# Altium schematic sheet UART2.SchDoc
size A2
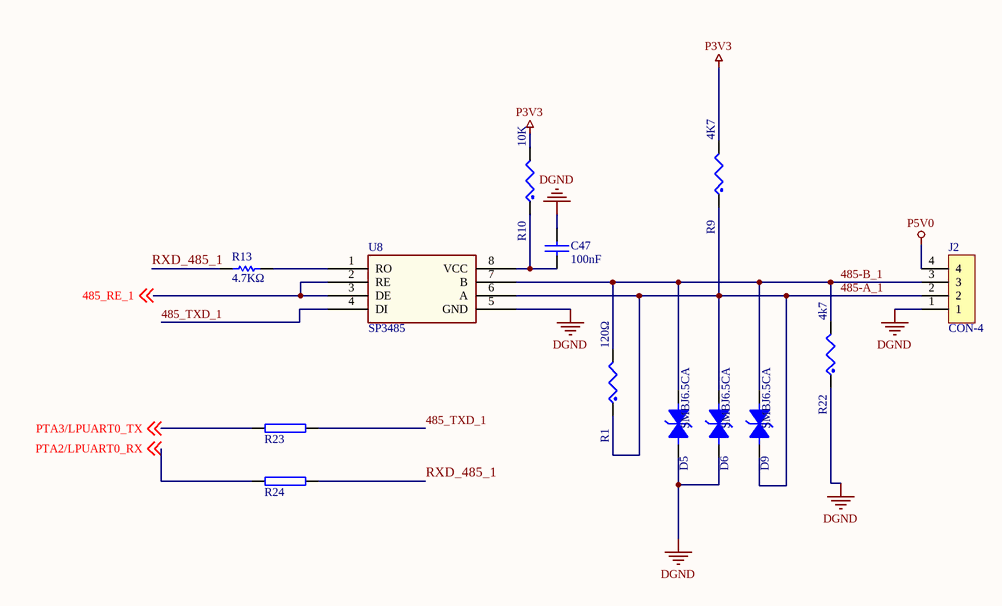
[diagram p0: UART2.SchDoc]

## Parts
C47  100nF  [CC0402_25]
D5  SMBJ6.5CA  [1812]
D6  SMBJ6.5CA  [1812]
D9  SMBJ6.5CA  [1812]
J2  CON-4  [GSP003RC-4-3.5]
R1  120Ω  [RC0603_OV]
R9  4K7  [RC0603_OV]
R10  10K  [RC0603_OV]
R13  4.7KΩ  [R0402]
R22  4k7  [RC0603_OV]
R23  0  [RC0402_25]  (value not drawn)
R24  0  [RC0402_25]  (value not drawn)
U8  SP3485  [SOP-8]

## Nets
DGND: C47.2 D5.1(CATHODE) D6.1(CATHODE) J2.1 R22.1 U8.5(GND)
P3V3: R9.2 R10.2
P5V0: J2.4
485-A_1: D6.2(ANODE) D9.1(CATHODE) J2.2 R1.1 R9.1 U8.6(A)
485-B_1: D5.2(ANODE) D9.2(ANODE) J2.3 R1.2 R22.2 U8.7(B)
485_RE_1: U8.2(RE) U8.3(DE) ; off-sheet 485_RE_1
485_TXD_1: R23.1 U8.4(DI)
PTA2/LPUART0_RX: R24.2 ; off-sheet PTA2/LPUART0_RX
PTA3/LPUART0_TX: R23.2 ; off-sheet PTA3/LPUART0_TX
RXD_485_1: R13.2 R24.1
NetC47_1: C47.1 R10.1 U8.8(VCC)
NetR13_1: R13.1 U8.1(RO)

## Library data of the parts
C47 = CAP: Capacitor
D5 D6 D9 = BV05C
R1 R9 R10 R22 = RES: RES MF ZERO OHM 1/10W -- 0603; CLASS: DISCRETE; MFG_PN01: RC0603FR-070RL; MFG_NAME01: YAGEO AMERICA; Temp Range: –55 °C to +155 °C; CAD_APPROVED: Yes; FPLIST: RC0603_OV,RC0603,R603-X2,r603-x2_b,0603_CC,IND_0603HP_NSP,CC0603_OV_NSP; AGILE_PN: 470-80866; PCB Footprint: RC0603_OV; ROHS: Yes; HEIGHT: 0.6
R13 = Res1: Resistor; Value: 1K; Published: 8-Jun-2000; LatestRevisionDate: 17-Jul-2002; LatestRevisionNote: Re-released for DXP Platform.; PackageReference: AXIAL-0.3; Publisher: Altium Limited; PackageDescription: Axial Device, Thru-Hole; 2 Leads; 0.3 in Pin Spacing
R23 R24 = RES2